# EAGLE schematic lcd-no-knob (EAGLE 5.11)
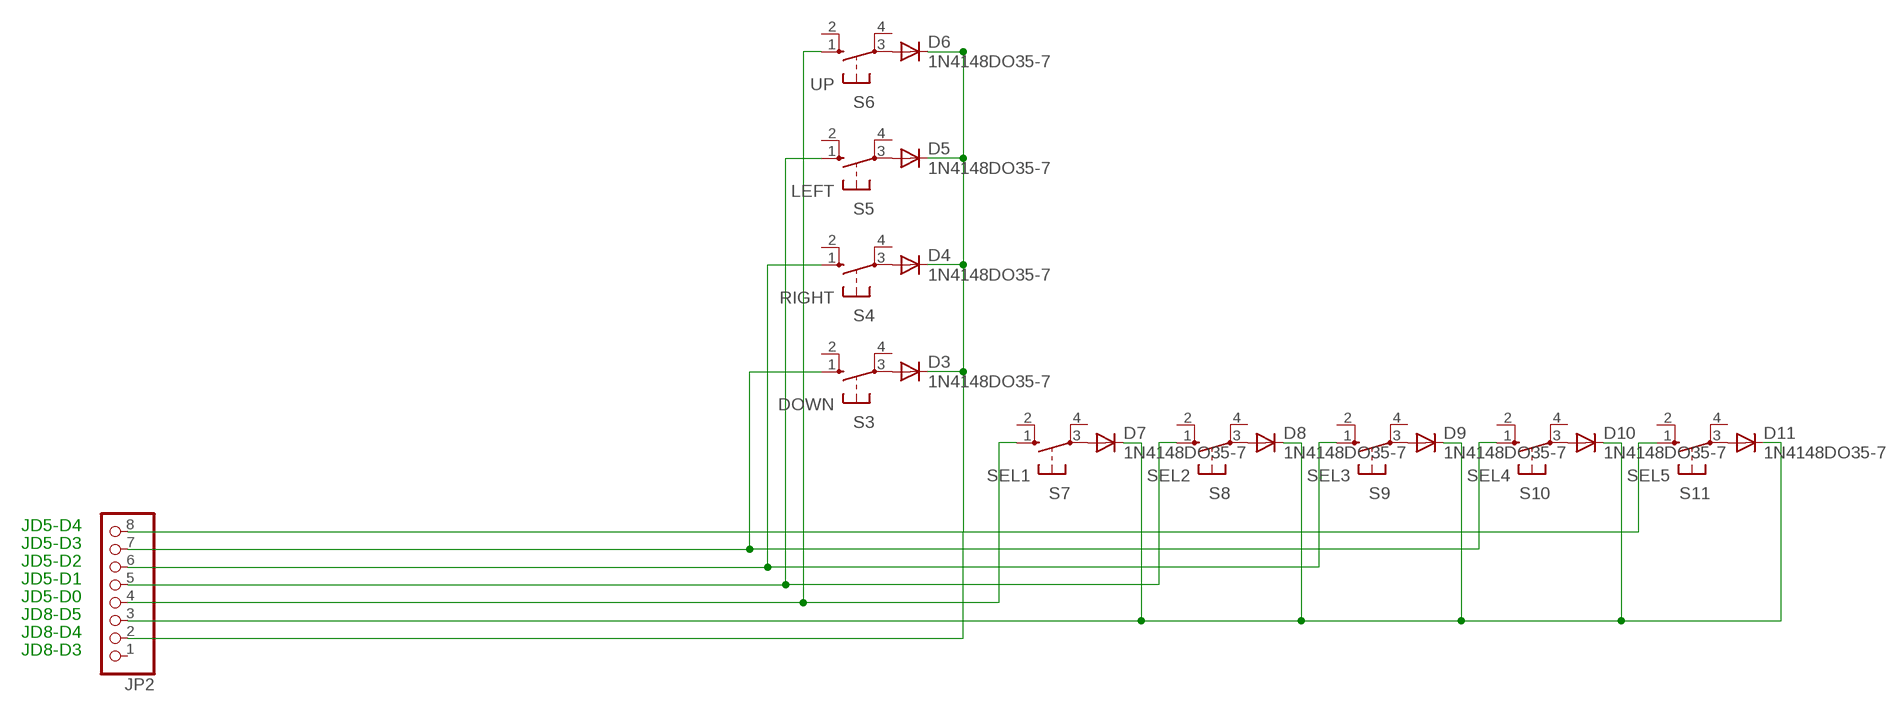
[diagram p0: schematic, sheet 1]

## Parts
D3  1N4148DO35-7  DIODE-DO214AC  [DO214AC]
D4  1N4148DO35-7  DIODE-DO214AC  [DO214AC]
D5  1N4148DO35-7  DIODE-DO214AC  [DO214AC]
D6  1N4148DO35-7  DIODE-DO214AC  [DO214AC]
D7  1N4148DO35-7  DIODE-DO214AC  [DO214AC]
D8  1N4148DO35-7  DIODE-DO214AC  [DO214AC]
D9  1N4148DO35-7  DIODE-DO214AC  [DO214AC]
D10  1N4148DO35-7  DIODE-DO214AC  [DO214AC]
D11  1N4148DO35-7  DIODE-DO214AC  [DO214AC]
JP2  PINHD-1X8  [1X08]
S3  DOWN  10-XX  [B3F-10XX]
S4  RIGHT  10-XX  [B3F-10XX]
S5  LEFT  10-XX  [B3F-10XX]
S6  UP  10-XX  [B3F-10XX]
S7  SEL1  10-XX  [B3F-10XX]
S8  SEL2  10-XX  [B3F-10XX]
S9  SEL3  10-XX  [B3F-10XX]
S10  SEL4  10-XX  [B3F-10XX]
S11  SEL5  10-XX  [B3F-10XX]

## Nets
N$4: JP2.7 S3.1(S) S10.1(S)
N$7: D3.A S3.3(P)
N$8: D4.A S4.3(P)
N$9: D5.A S5.3(P)
N$10: D6.A S6.3(P)
N$11: D7.A S7.3(P)
N$12: D8.A S8.3(P)
N$13: D9.A S9.3(P)
N$14: D10.A S10.3(P)
N$15: D11.A S11.3(P)
N$17: JP2.4 S6.1(S) S7.1(S)
N$18: D3.C D4.C D5.C D6.C JP2.2
N$19: D7.C D8.C D9.C D10.C D11.C JP2.3
N$20: JP2.5 S5.1(S) S8.1(S)
N$21: JP2.6 S4.1(S) S9.1(S)
N$22: JP2.8 S11.1(S)
Unconnected: JP2.1 S3.2(S1) S3.4(P1) S4.2(S1) S4.4(P1) S5.2(S1) S5.4(P1) S6.2(S1) S6.4(P1) S7.2(S1) S7.4(P1) S8.2(S1) S8.4(P1) S9.2(S1) S9.4(P1) S10.2(S1) S10.4(P1) S11.2(S1) S11.4(P1)

## Notes on the sheet
- JD5-D4
- JD5-D3
- JD5-D2
- JD5-D1
- JD5-D0
- JD8-D5
- JD8-D4
- JD8-D3

## Library data of the parts
D3-D11 = diode:DIODE-: DIODE
JP2 = pinhead:PINHD-1X8: PIN HEADER
S3-S11 = switch-omron:10-XX: OMRON SWITCH; MPN: B3F-1000; OC_FARNELL: 176432; OC_NEWARK: 36M3542